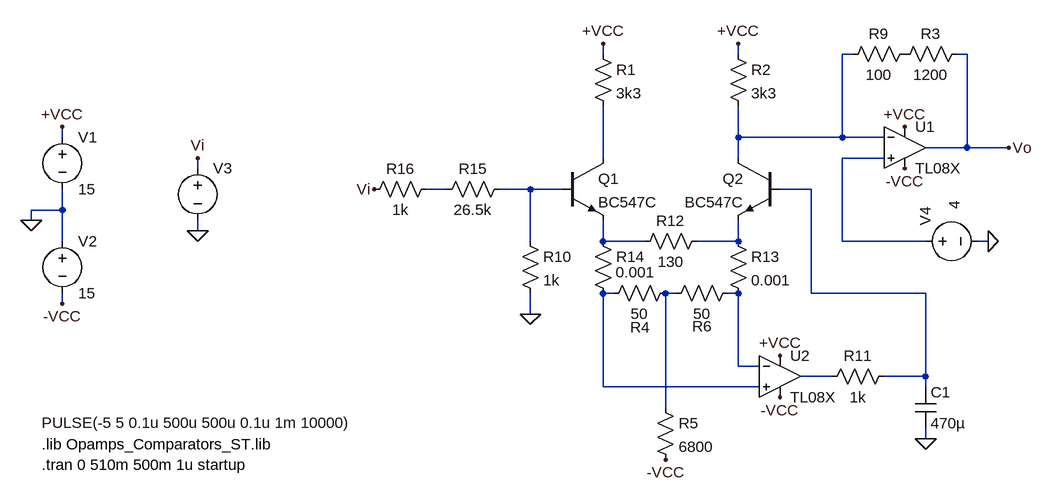
[diagram p0: schematic CrazyStuff_v2.asc]
CrazyStuff_v2.asc, the LTspice schematic file:
Version 4
SHEET 1 880 808
WIRE -224 -256 -224 -272
WIRE -16 -256 -16 -272
WIRE 160 -256 144 -256
WIRE 336 -256 320 -256
WIRE -1056 -128 -1056 -144
WIRE -16 -128 -16 -176
WIRE 144 -128 144 -256
WIRE 144 -128 -16 -128
WIRE 208 -128 144 -128
WIRE 336 -112 336 -256
WIRE 336 -112 272 -112
WIRE 400 -112 336 -112
WIRE -224 -96 -224 -176
WIRE -16 -96 -16 -128
WIRE 208 -96 144 -96
WIRE -848 -80 -848 -96
WIRE -464 -48 -496 -48
WIRE -336 -48 -384 -48
WIRE -288 -48 -336 -48
WIRE 96 -48 48 -48
WIRE -1056 -16 -1056 -48
WIRE -1056 -16 -1104 -16
WIRE -1104 0 -1104 -16
WIRE -848 16 -848 0
WIRE -1056 32 -1056 -16
WIRE -336 32 -336 -48
WIRE -224 32 -224 0
WIRE -160 32 -224 32
WIRE -16 32 -16 0
WIRE -16 32 -80 32
WIRE 144 32 144 -96
WIRE 272 32 144 32
WIRE 368 32 352 32
WIRE -208 112 -224 112
WIRE -112 112 -128 112
WIRE -16 112 -32 112
WIRE 96 112 96 -48
WIRE 272 112 96 112
WIRE -1056 128 -1056 112
WIRE -336 144 -336 112
WIRE -16 224 -16 112
WIRE 16 224 -16 224
WIRE 128 240 80 240
WIRE 272 240 272 112
WIRE 272 240 208 240
WIRE -224 256 -224 112
WIRE 16 256 -224 256
WIRE 272 256 272 240
WIRE -128 288 -128 112
WIRE 272 336 272 320
FLAG -1104 0 0
FLAG -1056 -144 +VCC
FLAG -1056 128 -VCC
FLAG -848 16 0
FLAG -848 -96 Vi
FLAG -16 -272 +VCC
FLAG -224 -272 +VCC
FLAG 240 -144 +VCC
FLAG 240 -80 -VCC
FLAG 400 -112 Vo
FLAG -336 144 0
FLAG 48 208 +VCC
FLAG 48 272 -VCC
FLAG 272 336 0
FLAG -128 368 -VCC
FLAG -576 -48 Vi
FLAG 368 32 0
SYMBOL voltage -1056 -144 R0
WINDOW 123 0 0 Left 0
WINDOW 39 0 0 Left 0
SYMATTR InstName V1
SYMATTR Value 15
SYMBOL voltage -1056 16 R0
WINDOW 123 0 0 Left 0
WINDOW 39 0 0 Left 0
SYMATTR InstName V2
SYMATTR Value 15
SYMBOL voltage -848 -96 R0
WINDOW 3 -240 407 Left 2
WINDOW 123 0 0 Left 0
WINDOW 39 0 0 Left 0
SYMATTR Value PULSE(-5 5 0.1u 500u 500u 0.1u 1m 10000)
SYMATTR InstName V3
SYMBOL npn -288 -96 R0
SYMATTR InstName Q1
SYMATTR Value BC547C
SYMBOL npn 48 -96 M0
SYMATTR InstName Q2
SYMATTR Value BC547C
SYMBOL res -240 -272 R0
SYMATTR InstName R1
SYMATTR Value 3k3
SYMBOL res -32 -272 R0
SYMATTR InstName R2
SYMATTR Value 3k3
SYMBOL Opamps\\opamp2 240 -176 R0
SYMATTR InstName U1
SYMATTR Value TL08X
SYMBOL res 336 -272 R90
WINDOW 0 0 56 VBottom 2
WINDOW 3 32 56 VTop 2
SYMATTR InstName R3
SYMATTR Value 1200
SYMBOL res -112 96 R90
WINDOW 0 84 55 VBottom 2
WINDOW 3 32 56 VTop 2
SYMATTR InstName R4
SYMATTR Value 50
SYMBOL res -16 96 R90
WINDOW 0 82 56 VBottom 2
WINDOW 3 32 56 VTop 2
SYMATTR InstName R6
SYMATTR Value 50
SYMBOL res 256 -272 R90
WINDOW 0 0 56 VBottom 2
WINDOW 3 32 56 VTop 2
SYMATTR InstName R9
SYMATTR Value 100
SYMBOL res -352 16 R0
SYMATTR InstName R10
SYMATTR Value 1k
SYMBOL res 112 256 R270
WINDOW 0 32 56 VTop 2
WINDOW 3 0 56 VBottom 2
SYMATTR InstName R11
SYMATTR Value 1k
SYMBOL Opamps\\opamp2 48 176 R0
SYMATTR InstName U2
SYMATTR Value TL08X
SYMBOL cap 256 256 R0
SYMATTR InstName C1
SYMATTR Value 470µ
SYMBOL res -64 16 R90
WINDOW 0 0 56 VBottom 2
WINDOW 3 32 56 VTop 2
SYMATTR InstName R12
SYMATTR Value 130
SYMBOL res -32 16 R0
SYMATTR InstName R13
SYMATTR Value 0.001
SYMBOL res -240 16 R0
WINDOW 3 35 64 Left 2
SYMATTR InstName R14
SYMATTR Value 0.001
SYMBOL res -368 -64 R90
WINDOW 0 0 56 VBottom 2
WINDOW 3 32 56 VTop 2
SYMATTR InstName R15
SYMATTR Value 26.5k
SYMBOL res -480 -64 R90
WINDOW 0 0 56 VBottom 2
WINDOW 3 32 56 VTop 2
SYMATTR InstName R16
SYMATTR Value 1k
SYMBOL res -144 272 R0
SYMATTR InstName R5
SYMATTR Value 6800
SYMBOL voltage 256 32 R270
WINDOW 3 49 60 Left 2
WINDOW 123 0 0 Left 0
WINDOW 39 0 0 Left 0
SYMATTR Value 4
SYMATTR InstName V4
TEXT -1088 376 Left 2 !.tran 0 510m 500m 1u startup
TEXT -1088 344 Left 2 !.lib Opamps_Comparators_ST.lib

The netlist it stands for:
* CrazyStuff_v2.asc
V1 +VCC 0 15
V2 0 -VCC 15
V3 Vi 0 PULSE(-5 5 0.1u 500u 500u 0.1u 1m 10000)
Q1 N002 N005 N007 0 BC547C
Q2 N001 N006 N008 0 BC547C
R1 +VCC N002 3k3
R2 +VCC N001 3k3
XU1 N003 N001 +VCC -VCC Vo TL08X  ; pins In+ In- V+ V- OUT
R3 Vo P001 1200
R4 N010 N009 50
R6 N011 N010 50
R9 P001 N001 100
R10 N005 0 1k
R11 N012 N006 1k
XU2 N009 N011 +VCC -VCC N012 TL08X  ; pins In+ In- V+ V- OUT
C1 N006 0 470µ
R12 N008 N007 130
R13 N008 N011 0.001
R14 N007 N009 0.001
R15 N005 N004 26.5k
R16 N004 Vi 1k
R5 N010 -VCC 6800
V4 N003 0 4
.model NPN NPN
.model PNP PNP
.lib standard.bjt
.tran 0 510m 500m 1u startup
.lib Opamps_Comparators_ST.lib
.backanno
.end